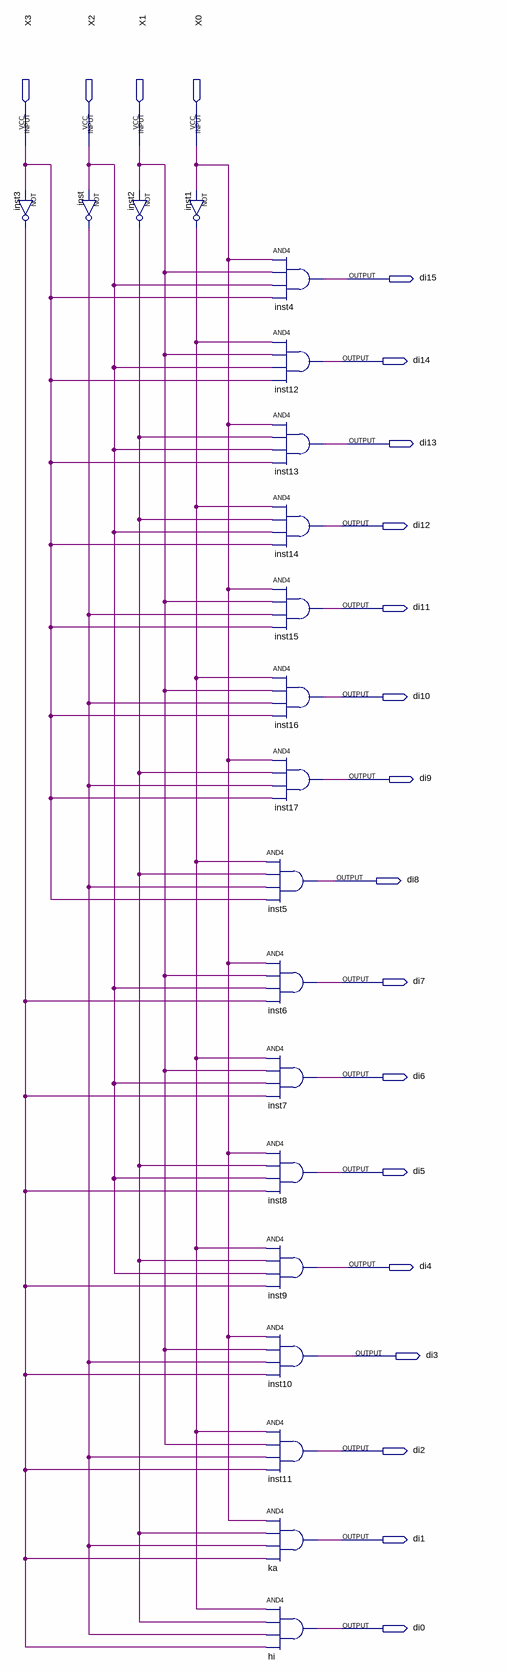
[diagram p0: schematic sheet]
// Quartus schematic Block2.bdf as structural Verilog: 20 symbols, 20 pins
module Block2 (
  input  X3,
  input  X2,
  input  X1,
  input  X0,
  output di15,
  output di14,
  output di13,
  output di12,
  output di11,
  output di10,
  output di9,
  output di8,
  output di7,
  output di6,
  output di5,
  output di4,
  output di3,
  output di2,
  output di1,
  output di0
);

  wire inst1_out, inst2_out, inst3_out, inst_out;

  not inst3 (inst3_out, X3);
  not inst (inst_out, X2);
  not inst2 (inst2_out, X1);
  not inst1 (inst1_out, X0);
  and inst4 (di15, X0, X1, X2, X3);
  and inst12 (di14, inst1_out, X1, X2, X3);
  and inst13 (di13, X0, inst2_out, X2, X3);
  and inst14 (di12, inst1_out, inst2_out, X2, X3);
  and inst15 (di11, X0, X1, inst_out, X3);
  and inst16 (di10, inst1_out, X1, inst_out, X3);
  and inst17 (di9, X0, inst2_out, inst_out, X3);
  and inst5 (di8, inst1_out, inst2_out, inst_out, X3);
  and inst6 (di7, X0, X1, X2, inst3_out);
  and inst7 (di6, inst1_out, X1, X2, inst3_out);
  and inst8 (di5, X0, inst2_out, X2, inst3_out);
  and inst9 (di4, inst1_out, inst2_out, X2, inst3_out);
  and inst10 (di3, X0, X1, inst_out, inst3_out);
  and inst11 (di2, inst1_out, X1, inst_out, inst3_out);
  and ka (di1, X0, inst2_out, inst_out, inst3_out);
  and hi (di0, inst1_out, inst2_out, inst_out, inst3_out);
endmodule
